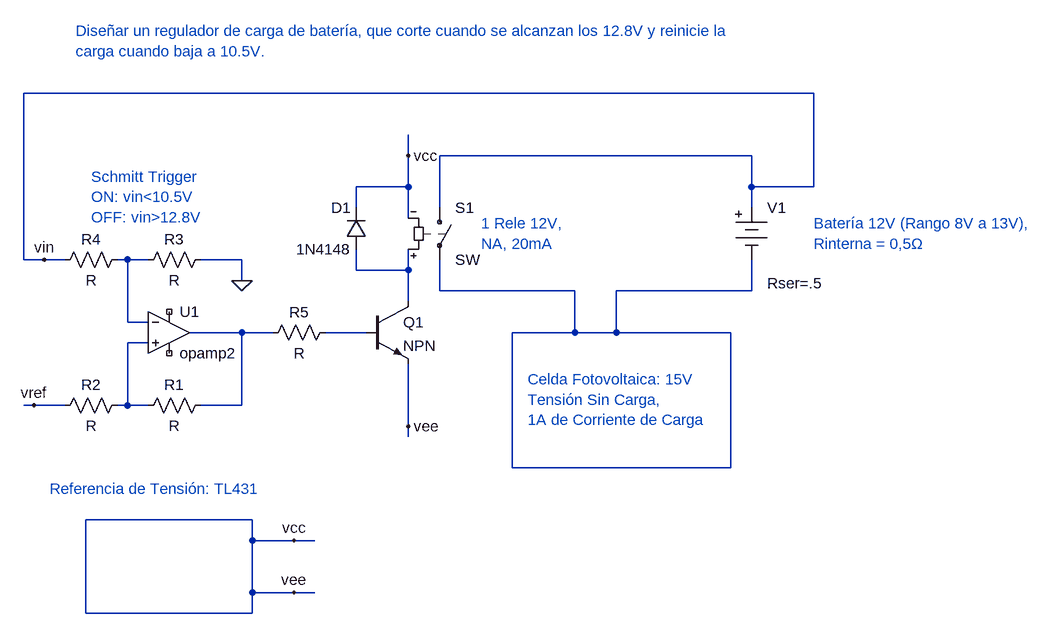
[diagram p0: schematic adicional1.asc]
adicional1.asc, the LTspice schematic file:
Version 4
SHEET 1 1436 1200
WIRE 1056 368 -160 368
WIRE 432 464 432 432
WIRE 960 464 480 464
WIRE 432 512 432 464
WIRE 432 512 352 512
WIRE 960 512 960 464
WIRE 1056 512 1056 368
WIRE 1056 512 960 512
WIRE 352 544 352 512
WIRE 480 544 480 464
WIRE 960 544 960 512
WIRE 432 560 432 512
WIRE -160 624 -160 368
WIRE -128 624 -160 624
WIRE -96 624 -128 624
WIRE 0 624 -16 624
WIRE 32 624 0 624
WIRE 176 624 112 624
WIRE 352 640 352 608
WIRE 432 640 432 608
WIRE 432 640 352 640
WIRE 176 656 176 624
WIRE 480 672 480 624
WIRE 688 672 480 672
WIRE 960 672 960 624
WIRE 960 672 752 672
WIRE 432 688 432 640
WIRE 0 720 0 624
WIRE 32 720 0 720
WIRE 176 736 96 736
WIRE 224 736 176 736
WIRE 368 736 304 736
WIRE 688 736 688 672
WIRE 688 736 592 736
WIRE 752 736 752 672
WIRE 752 736 688 736
WIRE 928 736 752 736
WIRE 32 752 0 752
WIRE -144 848 -160 848
WIRE -96 848 -144 848
WIRE 0 848 0 752
WIRE 0 848 -16 848
WIRE 32 848 0 848
WIRE 176 848 176 736
WIRE 176 848 112 848
WIRE 432 880 432 784
WIRE 432 896 432 880
WIRE 592 944 592 736
WIRE 928 944 928 736
WIRE 928 944 592 944
WIRE 192 1024 -64 1024
WIRE 192 1056 192 1024
WIRE 256 1056 192 1056
WIRE 288 1056 256 1056
WIRE 192 1136 192 1056
WIRE 256 1136 192 1136
WIRE 288 1136 256 1136
WIRE -64 1168 -64 1024
WIRE 192 1168 192 1136
WIRE 192 1168 -64 1168
FLAG 176 656 0
FLAG 432 464 vcc
FLAG 432 880 vee
FLAG -144 848 vref
FLAG 256 1136 vee
FLAG 256 1056 vcc
FLAG -128 624 vin
SYMBOL sw 480 528 R0
SYMATTR InstName S1
SYMBOL diode 368 608 R180
WINDOW 0 24 64 Left 2
WINDOW 3 24 0 Left 2
SYMATTR InstName D1
SYMATTR Value 1N4148
SYMBOL OpAmps\\opamp2 64 672 R0
SYMATTR InstName U1
SYMBOL npn 368 688 R0
SYMATTR InstName Q1
SYMBOL Misc\\battery 960 528 R0
WINDOW 123 0 0 Left 0
WINDOW 39 24 132 Left 2
SYMATTR InstName V1
SYMATTR Value ""
SYMATTR SpiceLine Rser=.5
SYMBOL res 128 832 R90
WINDOW 0 0 56 VBottom 2
WINDOW 3 32 56 VTop 2
SYMATTR InstName R1
SYMBOL res 0 832 R90
WINDOW 0 0 56 VBottom 2
WINDOW 3 32 56 VTop 2
SYMATTR InstName R2
SYMBOL res 128 608 R90
WINDOW 0 0 56 VBottom 2
WINDOW 3 32 56 VTop 2
SYMATTR InstName R3
SYMBOL res 0 608 R90
WINDOW 0 0 56 VBottom 2
WINDOW 3 32 56 VTop 2
SYMATTR InstName R4
SYMBOL res 320 720 R90
WINDOW 0 0 56 VBottom 2
WINDOW 3 32 56 VTop 2
SYMATTR InstName R5
TEXT -80 272 Left 2 ;Diseñar un regulador de carga de batería, que corte cuando se alcanzan los 12.8V y reinicie la\ncarga cuando baja a 10.5V.
TEXT 544 568 Left 2 ;1 Rele 12V, \nNA, 20mA
TEXT -120 976 Left 2 ;Referencia de Tensión: TL431
TEXT 1056 568 Left 2 ;Batería 12V (Rango 8V a 13V),\nRinterna = 0,5Ω
TEXT 616 808 Left 2 ;Celda Fotovoltaica: 15V \nTensión Sin Carga, \n1A de Corriente de Carga
TEXT -56 496 Left 2 ;Schmitt Trigger\nON: vin<10.5V\nOFF: vin>12.8V

The netlist it stands for:
* adicional1.asc
S1 vin N003 N002 vee SW
D1 N002 vee 1N4148
XU1 N006 N001 NC_01 NC_02 N004 opamp2  ; pins In+ In- V+ V- OUT
Q1 N002 N005 vee 0 NPN
V1 vin N003 Rser=.5
R1 N004 N006 R
R2 N006 vref R
R3 0 N001 R
R4 N001 vin R
R5 N005 N004 R
.model D D
.lib standard.dio
.model NPN NPN
.model PNP PNP
.lib standard.bjt
* Diseñar un regulador de carga de batería, que corte cuando se alcanzan los 12.8V y reinicie la
* carga cuando baja a 10.5V.
* 1 Rele 12V,
* NA, 20mA
* Referencia de Tensión: TL431
* Batería 12V (Rango 8V a 13V),
* Rinterna = 0,5Ω
* Celda Fotovoltaica: 15V
* Tensión Sin Carga,
* 1A de Corriente de Carga
* Schmitt Trigger
* ON: vin<10.5V
* OFF: vin>12.8V
.backanno
.end